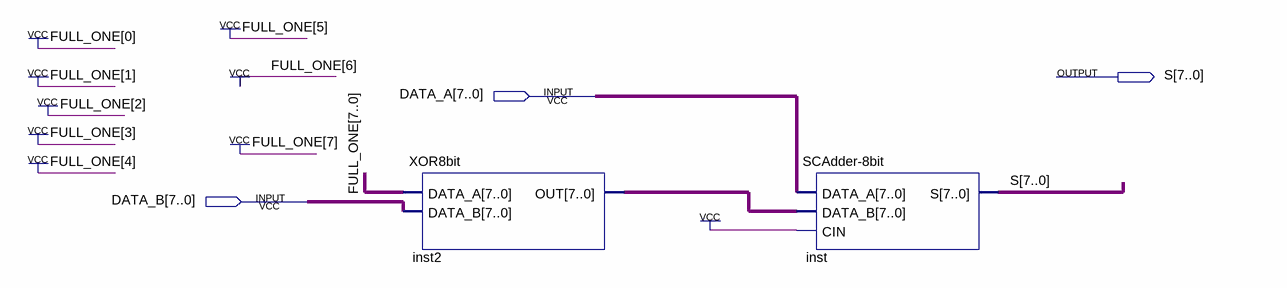
[diagram p0: schematic sheet]
// Quartus schematic SUB_8bit.bdf as structural Verilog: 2 symbols, 3 pins
module SUB_8bit (
  input  [7:0] DATA_A,
  input  [7:0] DATA_B,
  output [7:0] S
);

  wire [7:0] inst2_out;

  XOR8bit inst2 (.DATA_A({8{1'b1}}), .DATA_B(DATA_B), .OUT(inst2_out));
  \SCAdder-8bit  inst (.DATA_A(DATA_A), .DATA_B(inst2_out), .CIN(1'b1), .S(S));
endmodule
